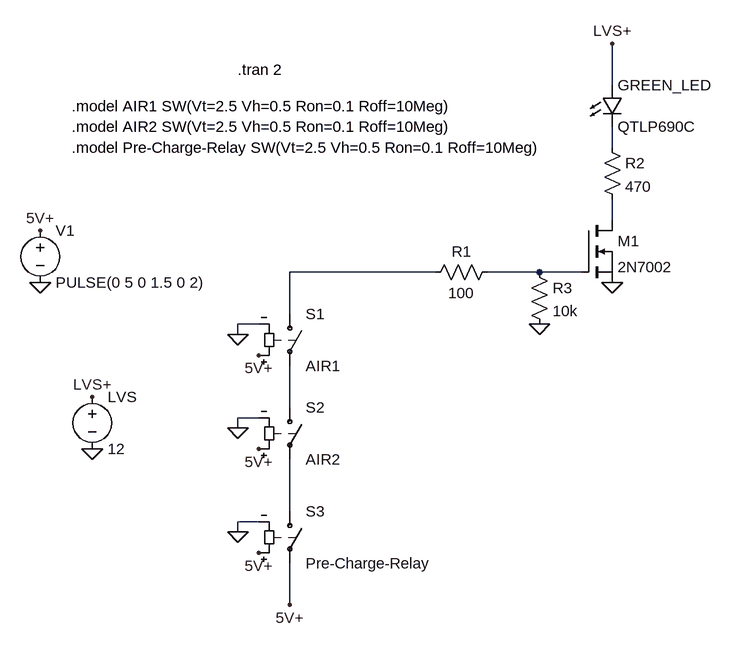
[diagram p0: schematic GREEN_LIGHT_SYSTEM.asc]
GREEN_LIGHT_SYSTEM.asc, the LTspice schematic file:
Version 4
SHEET 1 880 768
WIRE 576 -112 576 -176
WIRE 576 -16 576 -48
WIRE 576 96 576 64
WIRE 304 176 80 176
WIRE 464 176 384 176
WIRE 528 176 464 176
WIRE 80 240 80 176
WIRE 32 256 0 256
WIRE 0 272 0 256
WIRE 80 384 80 320
WIRE 32 400 0 400
WIRE 0 416 0 400
WIRE 80 544 80 464
WIRE 32 560 0 560
WIRE 0 576 0 560
WIRE 80 688 80 624
FLAG 0 272 0
FLAG 0 416 0
FLAG 0 576 0
FLAG -304 192 0
FLAG -304 112 5V+
FLAG 32 448 5V+
FLAG 32 608 5V+
FLAG 576 192 0
FLAG -224 448 0
FLAG -224 368 LVS+
FLAG 576 -176 LVS+
FLAG 32 304 5V+
FLAG 80 688 5V+
FLAG 464 256 0
SYMBOL sw 80 224 R0
SYMATTR InstName S1
SYMATTR Value AIR1
SYMBOL sw 80 368 R0
SYMATTR InstName S2
SYMATTR Value AIR2
SYMBOL sw 80 528 R0
SYMATTR InstName S3
SYMATTR Value Pre-Charge-Relay
SYMBOL Voltage -304 96 R0
SYMATTR InstName V1
SYMATTR Value PULSE(0 5 0 1.5 0 2)
SYMBOL nmos 528 96 R0
SYMATTR InstName M1
SYMATTR Value 2N7002
SYMBOL Res 400 160 R90
WINDOW 0 0 56 VBottom 2
WINDOW 3 32 56 VTop 2
SYMATTR InstName R1
SYMATTR Value 100
SYMBOL Res 560 -32 R0
SYMATTR InstName R2
SYMATTR Value 470
SYMBOL LED 560 -112 R0
SYMATTR InstName GREEN_LED
SYMATTR Value QTLP690C
SYMBOL voltage -224 352 R0
SYMATTR InstName LVS
SYMATTR Value 12
SYMBOL Res 448 160 R0
SYMATTR InstName R3
SYMATTR Value 10k
TEXT -256 -80 Left 2 !.model AIR1 SW(Vt=2.5 Vh=0.5 Ron=0.1 Roff=10Meg)
TEXT -256 -48 Left 2 !.model AIR2 SW(Vt=2.5 Vh=0.5 Ron=0.1 Roff=10Meg)
TEXT -256 -16 Left 2 !.model Pre-Charge-Relay SW(Vt=2.5 Vh=0.5 Ron=0.1 Roff=10Meg)
TEXT 0 -136 Left 2 !.tran 2

The netlist it stands for:
* GREEN_LIGHT_SYSTEM.asc
S1 N003 N005 5V+ 0 AIR1
S2 N005 N006 5V+ 0 AIR2
S3 N006 5V+ 5V+ 0 Pre-Charge-Relay
V1 5V+ 0 PULSE(0 5 0 1.5 0 2)
M1 N002 N004 0 0 2N7002
R1 N004 N003 100
R2 N001 N002 470
D§GREEN_LED LVS+ N001 QTLP690C
V§LVS LVS+ 0 12
R3 N004 0 10k
.model D D
.lib standard.dio
.model NMOS NMOS
.model PMOS PMOS
.lib standard.mos
.model AIR1 SW(Vt=2.5 Vh=0.5 Ron=0.1 Roff=10Meg)
.model AIR2 SW(Vt=2.5 Vh=0.5 Ron=0.1 Roff=10Meg)
.model Pre-Charge-Relay SW(Vt=2.5 Vh=0.5 Ron=0.1 Roff=10Meg)
.tran 2
.backanno
.end